# Altium project jetson_xavier_nx_board.PrjPcb (part 2 of 2)

## Sheet usb-debug.SchDoc: Jetson Xavier NX Board
size A3; PageSetup: Record=PageOptions|CenterHorizontal=True|CenterVertical=True|PrintScale=0.97|XCorrection=1.00|YCorrection=1.00|PrintKind=1|BorderSize=5000000|LeftOffset=0|BottomOffset=0|Orientation=2|PaperLength=2970|PaperWidth=2100|Scale=100|PaperSource=7|PrintQuality=600|MediaType=1|DitherType=10|PaperKind=A4|PrintScaleMode=1; Organization: Altium Limited; Address1: 3 Minna Close; Address2: Belrose; Address3: NSW 2085; Address4: Australia; Revision: Rev01
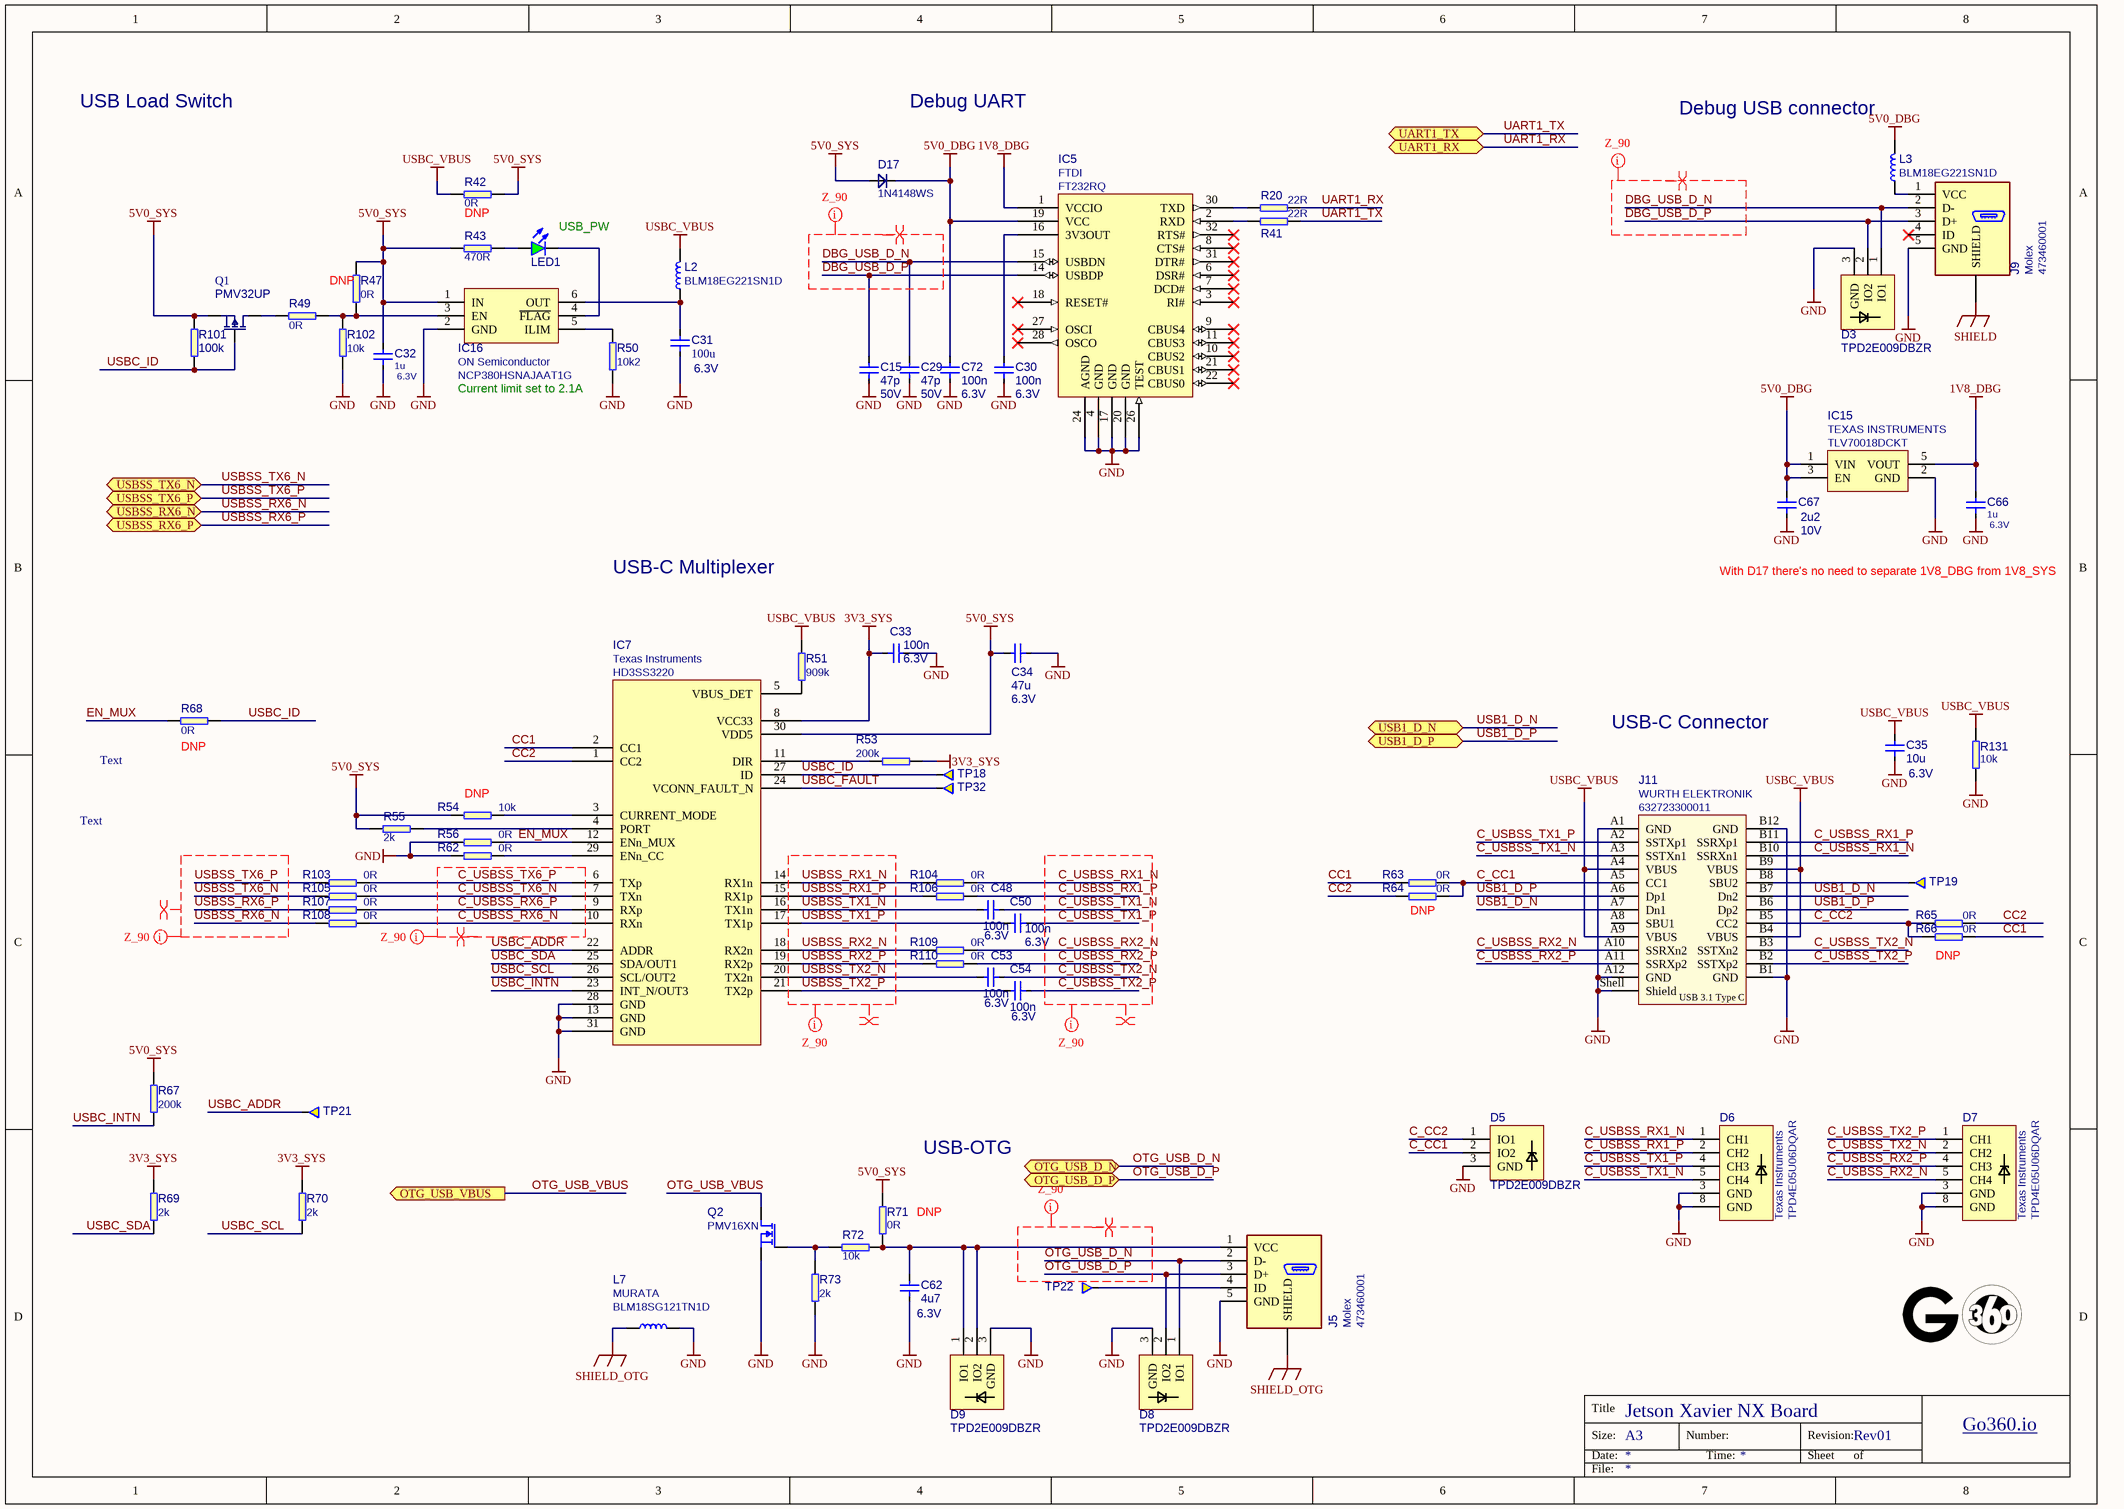
[diagram p6: usb-debug.SchDoc]

### Parts
C15  Voltage: 50V  [0402]  (hidden comment: 47p)
C29  Voltage: 50V  [0402]  (hidden comment: 47p)
C30  Voltage: 6.3V  [0402]  (hidden comment: 100n)
C31  Voltage: 6.3V  [1206]  (hidden comment: 100u)
C32  Voltage: 6.3V  [0402]  (hidden comment: 1u)
C33  Voltage: 6.3V  [0402]  (hidden comment: 100n)
C34  Voltage: 6.3V  [0805]  (hidden comment: 47u)
C35  Voltage: 6.3V  [0603]  (hidden comment: 10u)
C48  Voltage: 6.3V  [0402]  (hidden comment: 100n)
C50  Voltage: 6.3V  [0402]  (hidden comment: 100n)
C53  Voltage: 6.3V  [0402]  (hidden comment: 100n)
C54  Voltage: 6.3V  [0402]  (hidden comment: 100n)
C62  Voltage: 6.3V  [0402]  (hidden comment: 4u7)
C66  Voltage: 6.3V  [0402]  (hidden comment: 1u)
C67  Voltage: 10V  [0402]  (hidden comment: 2u2)
C72  Voltage: 6.3V  [0402]  (hidden comment: 100n)
D3  TPD2E009DBZR  [SOT-23]
D5  TPD2E009DBZR  [SOT-23]
D6  Manufacturer: Texas Instruments  PartSymbol: TPD4E05U06DQAR  [TPD4E05U06_PASS]  (hidden comment: TPD4E05U06)
D7  Manufacturer: Texas Instruments  PartSymbol: TPD4E05U06DQAR  [TPD4E05U06_PASS]  (hidden comment: TPD4E05U06)
D8  TPD2E009DBZR  [SOT-23s]
D9  TPD2E009DBZR  [SOT-23s]
D17  1N4148WS  [SOD-323]
IC5  Manufacturer: FTDI  [QFN-32]  (hidden comment: FT232RQ)
IC7  HD3SS3220  Manufacturer: Texas Instruments  [RNH0030A]
IC15  TLV70018DCKT  Manufacturer: TEXAS INSTRUMENTS  [SC70-5]
IC16  NCP380HSNAJAAT1G  Manufacturer: ON Semiconductor  [TSOP-6]
J5  Manufacturer: Molex  PartSymbol: 473460001  [CON-Molex-047346-0001]  (hidden comment: Molex 47346-0001)
J9  Manufacturer: Molex  PartSymbol: 473460001  [CON-Molex-047346-0001]  (hidden comment: Molex 47346-0001)
J11  632723300011  Manufacturer: WURTH ELEKTRONIK  [WE_632723300011]
L2  BLM18EG221SN1D  [0603]
L3  BLM18EG221SN1D  [0603]
L7  BLM18SG121TN1D  Manufacturer: MURATA  [0603]
LED1  KPT-1608SGC  [LED0603]  (value not drawn)
Q1  PMV32UP  [SOT-23s]
Q2  PMV16XN  [SOT-23s]
R20  22R  [0402]
R41  22R  [0402]
R42  0R  [0402]
R43  470R  [0402]
R47  0R  [0402]
R49  0R  [0402]
R50  10k2  [0402]
R51  909k  [0402]
R53  200k  [0402]
R54  10k  [0402]
R55  2k  [0402]
R56  0R  [0402]
R62  0R  [0402]
R63  0R  [0402]
R64  0R  [0402]
R65  0R  [0402]
R66  0R  [0402]
R67  200k  [0402]
R68  0R  [0402]
R69  2k  [0402]
R70  2k  [0402]
R71  0R  [0402]
R72  10k  [0402]
R73  2k  [0402]
R101  100k  [0402]
R102  10k  [0402]
R103  0R  [0402]
R104  0R  [0402]
R105  0R  [0402]
R106  0R  [0402]
R107  0R  [0402]
R108  0R  [0402]
R109  0R  [0402]
R110  0R  [0402]
R131  10k  [0402]
TP18  Testpad  [TP-R-1.5]  (value not drawn)  (no BOM)
TP19  Testpad  [TP-R-1.5]  (value not drawn)  (no BOM)
TP21  Testpad  [TP-R-1.5]  (value not drawn)  (no BOM)
TP22  Testpad  [TP-R-1.5]  (value not drawn)  (no BOM)
TP32  Testpad  [TP-R-1.5]  (value not drawn)  (no BOM)

### Ports
OTG_USB_D_N, OTG_USB_D_P, OTG_USB_VBUS (out), UART1_RX, UART1_TX, USB1_D_N, USB1_D_P, USBSS_RX6_N, USBSS_RX6_P, USBSS_TX6_N, USBSS_TX6_P

### Nets
1V8_DBG: C66.2 IC5.1(VCCIO) IC15.5(VOUT)
3V3_SYS: C33.1 IC7.8(VCC33) R53.2 R69.1 R70.1
5V0_DBG: C67.2 C72.2 D17.C IC5.19(VCC) IC15.1(VIN) IC15.3(EN) L3.2
5V0_SYS: C32.2 C34.2 D17.A IC7.30(VDD5) IC16.1(IN) Q1.2(S) R42.1 R43.2 R47.2 R54.1 R55.1 R67.2 R71.2 R101.2
GND: C15.1 C29.1 C30.1 C31.1 C32.1 C33.2 C34.1 C35.1 C62.1 C66.1 C67.1 C72.1 D3.3(GND) D5.3(GND) D6.3(GND) D6.8(GND) D7.3(GND) D7.8(GND) D8.3(GND) D9.3(GND) IC5.4(GND) IC5.17(GND) IC5.20(GND) IC5.24(AGND) IC5.26(TEST) IC7.13(GND) IC7.28(GND) IC7.31(GND) IC15.2(GND) IC16.2(GND) J5.5(GND) J9.5(GND) J11.A1(GND) J11.A12(GND) J11.B1(GND) J11.B12(GND) J11.Shell(Shield) L7.2 Q2.2(S) R50.1 R56.1 R62.1 R73.2 R102.1 R131.1
SHIELD: J9.S(SHIELD)
SHIELD_OTG: J5.S(SHIELD) L7.1
USBC_VBUS: C35.2 J11.A4(VBUS) J11.A9(VBUS) J11.B4(VBUS) J11.B9(VBUS) L2.2 R42.2 R51.2 R131.2
C_CC1: D5.2(IO2) J11.A5(CC1) R63.2 R64.2
C_CC2: D5.1(IO1) J11.B5(CC2) R65.1 R66.1
C_USBSS_RX1_N: D6.1(CH1) J11.B10(SSRXn1) R104.2
C_USBSS_RX1_P: D6.2(CH2) J11.B11(SSRXp1) R106.2
C_USBSS_RX2_N: D7.5(CH4) J11.A10(SSRXn2) R109.2
C_USBSS_RX2_P: D7.4(CH3) J11.A11(SSRXp2) R110.2
C_USBSS_RX6_N: IC7.10(RXn) R108.2
C_USBSS_RX6_P: IC7.9(RXp) R107.2
C_USBSS_TX1_N: C48.1 D6.5(CH4) J11.A3(SSTXn1)
C_USBSS_TX1_P: C50.1 D6.4(CH3) J11.A2(SSTXp1)
C_USBSS_TX2_N: C53.1 D7.2(CH2) J11.B3(SSTXn2)
C_USBSS_TX2_P: C54.1 D7.1(CH1) J11.B2(SSTXp2)
C_USBSS_TX6_N: IC7.7(TXn) R105.2
C_USBSS_TX6_P: IC7.6(TXp) R103.2
CC1: IC7.2(CC1) R63.1 R66.2
CC2: IC7.1(CC2) R64.1 R65.2
DBG_USB_D_N: C29.2 D3.1(IO1) IC5.15(USBDN) J9.2(D-)
DBG_USB_D_P: C15.2 D3.2(IO2) IC5.14(USBDP) J9.3(D+)
EN_MUX: IC7.12(ENn_MUX) R56.2 R68.1
OTG_USB_D_N: D8.1(IO1) J5.2(D-) ; port OTG_USB_D_N
OTG_USB_D_P: D8.2(IO2) J5.3(D+) ; port OTG_USB_D_P
OTG_USB_VBUS: Q2.3(D) ; port OTG_USB_VBUS
UART1_RX: R20.2 ; port UART1_RX
UART1_TX: R41.2 ; port UART1_TX
USB1_D_N: J11.A7(Dn1) J11.B7(Dn2) ; port USB1_D_N
USB1_D_P: J11.A6(Dp1) J11.B6(Dp2) ; port USB1_D_P
USBC_ADDR: IC7.22(ADDR) TP21.1
USBC_FAULT: IC7.24(VCONN_FAULT_N) TP32.1
USBC_ID: IC7.27(ID) Q1.1(G) R68.2 R101.1 TP18.1
USBC_INTN: IC7.23(INT_N/OUT3) R67.1
USBC_SCL: IC7.26(SCL/OUT2) R70.2
USBC_SDA: IC7.25(SDA/OUT1) R69.2
USBSS_RX1_N: IC7.14(RX1n) R104.1
USBSS_RX1_P: IC7.15(RX1p) R106.1
USBSS_RX2_N: IC7.18(RX2n) R109.1
USBSS_RX2_P: IC7.19(RX2p) R110.1
USBSS_RX6_N: R108.1 ; port USBSS_RX6_N
USBSS_RX6_P: R107.1 ; port USBSS_RX6_P
USBSS_TX1_N: C48.2 IC7.16(TX1n)
USBSS_TX1_P: C50.2 IC7.17(TX1p)
USBSS_TX2_N: C53.2 IC7.20(TX2n)
USBSS_TX2_P: C54.2 IC7.21(TX2p)
USBSS_TX6_N: R105.1 ; port USBSS_TX6_N
USBSS_TX6_P: R103.1 ; port USBSS_TX6_P
NetC30_2: C30.2 IC5.16(3V3OUT)
NetC31_2: C31.2 IC16.6(OUT) L2.1
NetC62_2: C62.2 D9.1(IO1) D9.2(IO2) J5.1(VCC) R71.1 R72.1
NetIC5_2: IC5.2(RXD) R41.1
NetIC5_30: IC5.30(TXD) R20.1
NetIC7_3: IC7.3(CURRENT_MODE) R54.2
NetIC7_4: IC7.4(PORT) R55.2
NetIC7_5: IC7.5(VBUS_DET) R51.1
NetIC7_11: IC7.11(DIR) R53.1
NetIC7_29: IC7.29(ENn_CC) R62.2
NetIC16_3: IC16.3(EN) R47.1 R49.2 R102.2
NetIC16_4: IC16.4(~{FLAG}) LED1.K
NetIC16_5: IC16.5(ILIM) R50.2
NetJ5_4: J5.4(ID) TP22.1
NetJ9_1: J9.1(VCC) L3.1
NetJ11_B8: J11.B8(SBU2) TP19.1
NetLED1_A: LED1.A R43.1
NetQ1_3: Q1.3(D) R49.1
NetQ2_1: Q2.1(G) R72.2 R73.1

Not connected (* = marked no-connect by the designer): IC5 3(RI#)* 6(DSR#)* 7(DCD#)* 8(CTS#)* 9(CBUS4)* 10(CBUS2)* 11(CBUS3)* 18(RESET#)* 21(CBUS1)* 22(CBUS0)* 27(OSCI)* 28(OSCO)* 31(DTR#)* 32(RTS#)*; J9 4(ID)*; J11 A8(SBU1)

### Layout directives
differential pair: C_USBSS_RX1_N, C_USBSS_RX1_P, C_USBSS_RX2_N, C_USBSS_RX2_P, C_USBSS_RX6_N, C_USBSS_RX6_P, C_USBSS_TX1_N, C_USBSS_TX1_P, C_USBSS_TX2_N, C_USBSS_TX2_P, C_USBSS_TX6_N, C_USBSS_TX6_P, DBG_USB_D_N, DBG_USB_D_P, OTG_USB_D_N, OTG_USB_D_P, USBSS_RX1_N, USBSS_RX1_P, USBSS_RX2_N, USBSS_RX2_P, USBSS_RX6_N, USBSS_RX6_P, USBSS_TX1_N, USBSS_TX1_P, USBSS_TX2_N, USBSS_TX2_P, USBSS_TX6_N, USBSS_TX6_P
net class Z_90: C_USBSS_RX1_N, C_USBSS_RX1_P, C_USBSS_RX2_N, C_USBSS_RX2_P, C_USBSS_RX6_N, C_USBSS_RX6_P, C_USBSS_TX1_N, C_USBSS_TX1_P, C_USBSS_TX2_N, C_USBSS_TX2_P, C_USBSS_TX6_N, C_USBSS_TX6_P, DBG_USB_D_N, DBG_USB_D_P, OTG_USB_D_N, OTG_USB_D_P, USBSS_RX1_N, USBSS_RX1_P, USBSS_RX2_N, USBSS_RX2_P, USBSS_RX6_N, USBSS_RX6_P, USBSS_TX1_N, USBSS_TX1_P, USBSS_TX2_N, USBSS_TX2_P, USBSS_TX6_N, USBSS_TX6_P

### Notes on the sheet
- USB Load Switch
- Debug UART
- (near L3) Debug USB connector
- (near R42) DNP
- (near LED1) USB_PW
- (near R47) DNP
- (near R50) Current limit set to 2.1A
- USB-C Multiplexer
- With D17 there's no need to separate 1V8_DBG from 1V8_SYS
- Text
- (near R68) DNP
- USB-C Connector
- (near R54) DNP
- (near R64) DNP
- (near R66) DNP
- USB-OTG
- DNP
- Title
- Size:
- Date:
- A3
- Number:
- Time:
- Revision:
- Sheet
- of
- Go360.io
- File:
- (in symbol WE_632723300011) USB 3.1 Type C

### Library data of the parts
C15 C29 = C_47p_0402: MLCC SMT Capacitor 47pF 0402; Manufacturer: KEMET; PartSymbol: C0402C470J5GACTU; PartNumber: C_47p_0402; Value: 47p
C30 C33 C72 = C_100n_0402: MLCC SMT Capacitor 100n 0402; Manufacturer: TDK; PartSymbol: C1005X5R0J104K050BA; Value: 100n; PartNumber: C_100n_0402
C31 = C_100u_1206: MLCC SMT Capacitor 100uF 1206; Manufacturer: KEMET; PartSymbol: C1206C107M9PACTU; PartNumber: C_100u_1206; Value: 100u
C32 C66 = C_1u_0402: MLCC SMT Capacitor 1uF 0402; Manufacturer: MULTICOMP; PartSymbol: MC0402F105Z6R3CT; PartNumber: C_1u_0402; Value: 1u
C34 = C_47u_0805: MLCC SMT Capacitor 47uF 0805; Manufacturer: KEMET; PartSymbol: C0805C476M9PACTU; PartNumber: C_47u_0805; Value: 47u
C35 = C_10u_0603: MLCC SMT Capacitor 10uF 0603; Manufacturer: Walsin; PartSymbol: 0603X106M6R3CT; PartNumber: C_10u_0603; Value: 10u
C48 C50 C53 C54 = C_100n_0402: MLCC SMT Capacitor 100n 0402; Manufacturer: TDK; PartSymbol: C1005X5R0J104K050BA; Voltage: 6.3; Value: 100n; PartNumber: C_100n_0402
C62 = C_4u7_0402: MLCC SMT Capacitor 4.7uF 0402; Manufacturer: MURATA; PartSymbol: GRM155R60J475ME87D; PartNumber: C_4u7_0402; Value: 4u7
C67 = C_2u2_0402: MLCC SMT Capacitor 2.2uF 0402; Manufacturer: TDK; PartSymbol: C1005X5R1A225K050BC; Value: 2u2; PartNumber: C_2u2_0402
D3 D5 D8 D9 = TPD2E009DBZR: DIODE, SCHOTTKY, 30V, 200MA, SOT-23; Manufacturer: NXP; PartNumber: TPD2E009DBZR; Value: TPD2E009DBZR; MPN: TPD2E009DBZR
D6 D7 = TPD4E05U06: ESD Suppressors 4-CH; PartNumber: TPD4E05U06_PASS; Value: TPD4E05U06
D17 = diode: Diode small signal; Manufacturer: ON SEMICONDUCTOR; PartNumber: 1N4148WS; Value: 1N4148WS; PartSymbol: 1N4148WS
IC5 = FT232RQ: USB to serial UART interface; PartSymbol: FT232RQ-REEL; Value: FT232RQ; PartNumber: FT232RQ
IC7 = HD3SS3220: IC DRP PORT CTLR USB-C 30WQFN; PartSymbol: HD3SS3220RNHT; PartNumber: HD3SS3220; Value: HD3SS3220
IC15 = TLV700: Voltage Regulator, 2V to 5.5V, 175mV Dropout, 1.8Vout, 200mAout; Value: TLV70018DCKT; PartNumber: TLV70018DCKT; PartSymbol: TLV70018DCKT
IC16 = NCP380HSNAJAAT1G: POWER LOAD SWITCH, HIGH SIDE; Value: NCP380HSNAJAAT1G; PartNumber: NCP380HSNAJAAT1G; PartSymbol: NCP380HSNAJAAT1G
J5 J9 = Micro USB B: USB - micro B Receptacle Connector 5 Position Surface Mount, Right Angle, Horizontal; PartNumber: CON-Molex-47346-0001; Value: Molex 47346-0001
J11 = WE_632723300011: USB 3.1 Type C Receptacle Horizontal THR WR-COM; PartNumber: WE_632723300011; Value: 632723300011; PartSymbol: 632723300011
L2 L3 = BLM18EG221SN1D: MURATA  BLM18EG221SN1D  FERRITE BEAD, 0.05OHM, 2A, 0603; Value: BLM18EG221SN1D; Manufacturer: MURATA; PartNumber: BLM18EG221SN1D; PartSymbol: BLM18EG221SN1D
L7 = BLM18SG121TN1D: FERRITE BEAD, 0.025OHM, 3A, 0603; Value: BLM18SG121TN1D; PartNumber: BLM18SG121TN1D; PartSymbol: BLM18SG121TN1D
LED1 = LED: LED Green 0603 case; Manufacturer: KINGBRIGHT; PartNumber: LED_G; Value: KPT-1608SGC; PartSymbol: KPT-1608SGC
Q1 = PMOS: P CH, 20V, 4A; Manufacturer: NXP; PartNumber: PMV32UP; Value: PMV32UP; PartSymbol: PMV32UP
Q2 = NMOS_PMV16XN: MOSFET, N CH; Manufacturer: NXP; Value: PMV16XN; PartNumber: PMV16XN; PartSymbol: PMV16XN
R20 R41 = R_22R_0402: RES, 22R, 0402; Manufacturer: VISHAY; PartSymbol: CRCW040222R0FKED; Value: 22R; PartNumber: R_22R_0402
R42 R47 R49 R56 R62-R66 R68 R71 R103-R110 = R_0R_0402: RES, 0R, 0402; Manufacturer: Panasonic; PartSymbol: ERJ2GE0R00X; PartNumber: R_0R_0402; Value: 0R
R43 = R_470R_0402: RES, 470R, 0402; Manufacturer: VISHAY; PartSymbol: CRCW0402470RFKED.; PartNumber: R_470R_0402; Value: 470R
R50 = R_10k2_0402: RES, 10k2, 0402, 0.1%; PartNumber: R_10k2_0402_0.1%; Manufacturer: TE CONECTIVITY; PartSymbol: CPF0402B10K2E1; Value: 10k2; Tolerance: 0.1%
R51 = R_909k_0402: RES, 909k, 0402; Manufacturer: Panasonic; PartSymbol: ERJ2RKF9093X; PartNumber: R_909k_0402; Value: 909k
R53 R67 = R_200k_0402: RES, 200k, 0402; Manufacturer: YAGEO; PartSymbol: RC0402FR-07200KL; PartNumber: R_200k_0402; Value: 200k
R54 R72 R102 R131 = R_10k_0402: RES, 10k, 0402; Manufacturer: MULTICOMP; PartSymbol: MCMR04X1002FTL; PartNumber: R_10k_0402; Value: 10k
R55 R69 R70 R73 = R_2k_0402: RES, 2k, 0402; Manufacturer: VISHAY; PartSymbol: CRCW04022K00FKED; PartNumber: R_2k_0402; Value: 2k
R101 = R_100k_0402: SMT Resistor 100k 0402; Manufacturer: VISHAY; PartSymbol: CRCW0402100KFKEDHP; Tolerance: 1%; PartNumber: R_100k_0402; Value: 100k
TP18 TP19 TP21 TP22 TP32 = Testpad: Testpad, round, 1.5mm; PartNumber: TP-R-1.5

## Sheet display.SchDoc: Jetson Xavier NX Board
size A3; PageSetup: Record=PageOptions|CenterHorizontal=True|CenterVertical=True|PrintScale=0.97|XCorrection=1.00|YCorrection=1.00|PrintKind=1|BorderSize=5000000|LeftOffset=0|BottomOffset=0|Orientation=2|PaperLength=2970|PaperWidth=2100|Scale=100|PaperSource=7|PrintQuality=600|MediaType=1|DitherType=10|PaperKind=A4|PrintScaleMode=1; Organization: Altium Limited; Address1: 3 Minna Close; Address2: Belrose; Address3: NSW 2085; Address4: Australia; Revision: Rev01
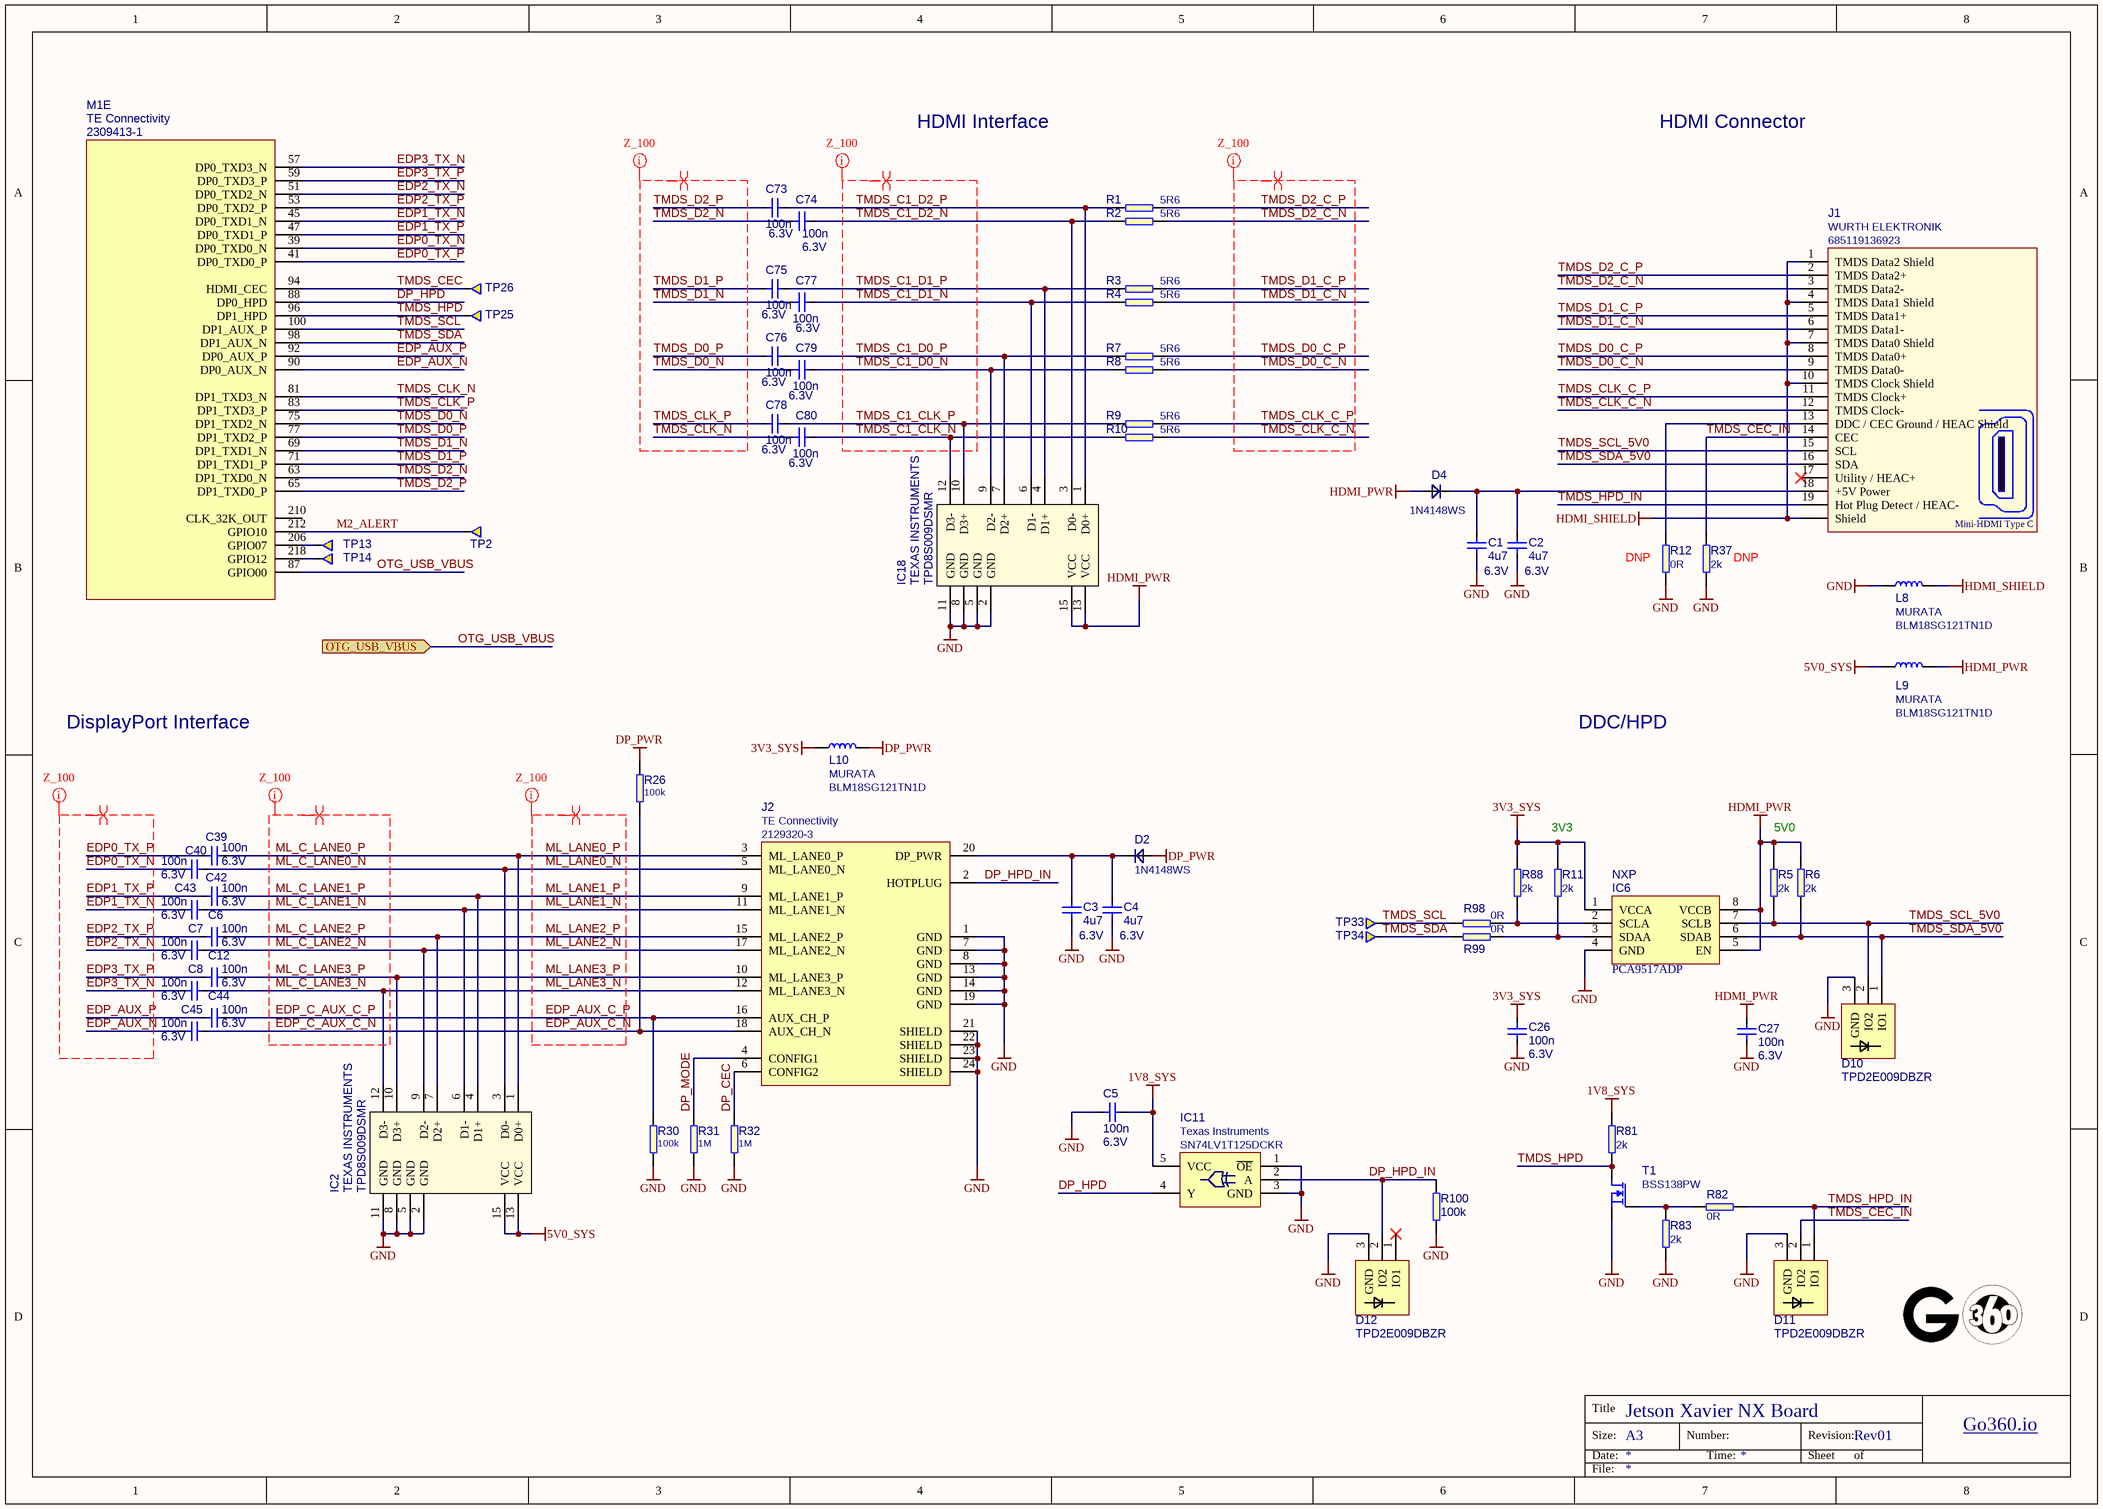
[diagram p7: display.SchDoc]

### Parts
(Parts that share a designator on the sheet are numbered #1, #2 ... from top to bottom, then left to right.)
C1  Voltage: 6.3V  [0402]  (hidden comment: 4u7)
C2  Voltage: 6.3V  [0402]  (hidden comment: 4u7)
C3  Voltage: 6.3V  [0402]  (hidden comment: 4u7)
C4  Voltage: 6.3V  [0402]  (hidden comment: 4u7)
C5  Voltage: 6.3V  [0402]  (hidden comment: 100n)
C6  Voltage: 6.3V  [0402]  (hidden comment: 100n)
C7  Voltage: 6.3V  [0402]  (hidden comment: 100n)
C8  Voltage: 6.3V  [0402]  (hidden comment: 100n)
C12  Voltage: 6.3V  [0402]  (hidden comment: 100n)
C26  Voltage: 6.3V  [0402]  (hidden comment: 100n)
C27  Voltage: 6.3V  [0402]  (hidden comment: 100n)
C39  Voltage: 6.3V  [0402]  (hidden comment: 100n)
C40  Voltage: 6.3V  [0402]  (hidden comment: 100n)
C42  Voltage: 6.3V  [0402]  (hidden comment: 100n)
C43  Voltage: 6.3V  [0402]  (hidden comment: 100n)
C44  Voltage: 6.3V  [0402]  (hidden comment: 100n)
C45  Voltage: 6.3V  [0402]  (hidden comment: 100n)
C73  Voltage: 6.3V  [0402]  (hidden comment: 100n)
C74  Voltage: 6.3V  [0402]  (hidden comment: 100n)
C75  Voltage: 6.3V  [0402]  (hidden comment: 100n)
C76  Voltage: 6.3V  [0402]  (hidden comment: 100n)
C77  Voltage: 6.3V  [0402]  (hidden comment: 100n)
C78  Voltage: 6.3V  [0402]  (hidden comment: 100n)
C79  Voltage: 6.3V  [0402]  (hidden comment: 100n)
C80  Voltage: 6.3V  [0402]  (hidden comment: 100n)
D2  1N4148WS  [SOD-323]
D4  1N4148WS  [SOD-323]
D10  TPD2E009DBZR  [SOT-23s]
D11  TPD2E009DBZR  [SOT-23s]
D12  TPD2E009DBZR  [SOT-23s]
IC2  Manufacturer: TEXAS INSTRUMENTS  PartSymbol: TPD8S009DSMR  [SON-15]  (hidden comment: TPD8S009)
IC6  PCA9517ADP  [MSOP-8]
IC11  SN74LV1T125DCKR  Manufacturer: Texas Instruments  [SC70-5]
IC18  Manufacturer: TEXAS INSTRUMENTS  PartSymbol: TPD8S009DSMR  [SON-15]  (hidden comment: TPD8S009)
J1  685119136923  Manufacturer: WURTH ELEKTRONIK  [WE_685119136923]
J2  2129320-3  Manufacturer: TE Connectivity  [2129320-3]
L8  BLM18SG121TN1D  Manufacturer: MURATA  [0603]
L9  BLM18SG121TN1D  Manufacturer: MURATA  [0603]
L10  BLM18SG121TN1D  Manufacturer: MURATA  [0603]
M1#2  Manufacturer: TE Connectivity  [jetson-nano-connector]  (hidden comment: 2309413-1)  (part E of 7)
R1  5R6  [0402]
R2  5R6  [0402]
R3  5R6  [0402]
R4  5R6  [0402]
R5  2k  [0402]
R6  2k  [0402]
R7  5R6  [0402]
R8  5R6  [0402]
R9  5R6  [0402]
R10  5R6  [0402]
R11  2k  [0402]
R12  0R  [0402]
R26  100k  [0402]
R30  100k  [0402]
R31  1M  [0402]
R32  1M  [0402]
R37  2k  [0402]
R81  2k  [0402]
R82  0R  [0402]
R83  2k  [0402]
R88  2k  [0402]
R98  0R  [0402]
R99  0R  [0402]
R100  100k  [0402]
T1  BSS138PW  [SC70-3]
TP2  Testpad  [TP-R-1.5]  (value not drawn)  (no BOM)
TP13  Testpad  [TP-R-1.5]  (value not drawn)  (no BOM)
TP14  Testpad  [TP-R-1.5]  (value not drawn)  (no BOM)
TP25  Testpad  [TP-R-1.5]  (value not drawn)  (no BOM)
TP26  Testpad  [TP-R-1.5]  (value not drawn)  (no BOM)
TP33  Testpad  [TP-R-1.5]  (value not drawn)  (no BOM)
TP34  Testpad  [TP-R-1.5]  (value not drawn)  (no BOM)

### Ports
OTG_USB_VBUS (in)

### Nets
1V8_SYS: C5.2 IC11.5(VCC) R81.1
3V3_SYS: C26.1 IC6.1(VCCA) L10.1 R11.1 R88.1
5V0_SYS: IC2.13(VCC) IC2.15(VCC) L9.1
DP_PWR: D2.A L10.2 R26.2
GND: C1.1 C2.1 C3.1 C4.1 C5.1 C26.2 C27.1 D10.3(GND) D11.3(GND) D12.3(GND) IC2.2(GND) IC2.5(GND) IC2.8(GND) IC2.11(GND) IC6.4(GND) IC11.1(~{OE}) IC11.3(GND) IC18.2(GND) IC18.5(GND) IC18.8(GND) IC18.11(GND) J2.1(GND) J2.7(GND) J2.8(GND) J2.13(GND) J2.14(GND) J2.19(GND) J2.21(SHIELD) J2.22(SHIELD) J2.23(SHIELD) J2.24(SHIELD) L8.1 R12.1 R30.1 R31.1 R32.1 R37.2 R83.2 R100.1 T1.2(S)
HDMI_PWR: C27.2 D4.A IC6.5(EN) IC6.8(VCCB) IC18.13(VCC) IC18.15(VCC) L9.2 R5.1 R6.1
HDMI_SHIELD: J1.1(TMDS_Data2_Shield) J1.4(TMDS_Data1_Shield) J1.7(TMDS_Data0_Shield) J1.10(TMDS_Clock_Shield) J1.Shell(Shield) L8.2
DP_CEC: J2.6(CONFIG2) R32.2
DP_HPD: IC11.4(Y) M1#2.88(DP0_HPD)
DP_HPD_IN: D12.2(IO2) IC11.2(A) J2.2(HOTPLUG) R100.2
DP_MODE: J2.4(CONFIG1) R31.2
EDP0_TX_N: C40.1 M1#2.39(DP0_TXD0_N)
EDP0_TX_P: C39.1 M1#2.41(DP0_TXD0_P)
EDP1_TX_N: C43.1 M1#2.45(DP0_TXD1_N)
EDP1_TX_P: C42.1 M1#2.47(DP0_TXD1_P)
EDP2_TX_N: C7.1 M1#2.51(DP0_TXD2_N)
EDP2_TX_P: C6.1 M1#2.53(DP0_TXD2_P)
EDP3_TX_N: C12.1 M1#2.57(DP0_TXD3_N)
EDP3_TX_P: C8.1 M1#2.59(DP0_TXD3_P)
EDP_AUX_C_N: C45.2 J2.18(AUX_CH_N) R26.1  [also labelled EDP_C_AUX_C_N]
EDP_AUX_C_P: C44.2 J2.16(AUX_CH_P) R30.2  [also labelled EDP_C_AUX_C_P]
EDP_AUX_N: C45.1 M1#2.90(DP0_AUX_N)
EDP_AUX_P: C44.1 M1#2.92(DP0_AUX_P)
M2_ALERT: M1#2.212(GPIO10) TP2.1
ML_C_LANE0_N: C40.2 IC2.3(D0-) J2.5(ML_LANE0_N)  [also labelled ML_LANE0_N]
ML_C_LANE0_P: C39.2 IC2.1(D0+) J2.3(ML_LANE0_P)  [also labelled ML_LANE0_P]
ML_C_LANE1_N: C43.2 IC2.6(D1-) J2.11(ML_LANE1_N)  [also labelled ML_LANE1_N]
ML_C_LANE1_P: C42.2 IC2.4(D1+) J2.9(ML_LANE1_P)  [also labelled ML_LANE1_P]
ML_C_LANE2_N: C7.2 IC2.9(D2-) J2.17(ML_LANE2_N)  [also labelled ML_LANE2_N]
ML_C_LANE2_P: C6.2 IC2.7(D2+) J2.15(ML_LANE2_P)  [also labelled ML_LANE2_P]
ML_C_LANE3_N: C12.2 IC2.12(D3-) J2.12(ML_LANE3_N)  [also labelled ML_LANE3_N]
ML_C_LANE3_P: C8.2 IC2.10(D3+) J2.10(ML_LANE3_P)  [also labelled ML_LANE3_P]
OTG_USB_VBUS: M1#2.87(GPIO00) ; port OTG_USB_VBUS
TMDS_C1_CLK_N: C80.2 IC18.12(D3-) R10.1
TMDS_C1_CLK_P: C78.2 IC18.10(D3+) R9.1
TMDS_C1_D0_N: C79.2 IC18.9(D2-) R8.1
TMDS_C1_D0_P: C76.2 IC18.7(D2+) R7.1
TMDS_C1_D1_N: C77.2 IC18.6(D1-) R4.1
TMDS_C1_D1_P: C75.2 IC18.4(D1+) R3.1
TMDS_C1_D2_N: C74.2 IC18.3(D0-) R2.1
TMDS_C1_D2_P: C73.2 IC18.1(D0+) R1.1
TMDS_CEC: M1#2.94(HDMI_CEC) TP26.1
TMDS_CEC_IN: D11.2(IO2) J1.14(CEC) R37.1
TMDS_CLK_C_N: J1.12(TMDS_Clock-) R10.2
TMDS_CLK_C_P: J1.11(TMDS_Clock+) R9.2
TMDS_CLK_N: C80.1 M1#2.81(DP1_TXD3_N)
TMDS_CLK_P: C78.1 M1#2.83(DP1_TXD3_P)
TMDS_D0_C_N: J1.9(TMDS_Data0-) R8.2
TMDS_D0_C_P: J1.8(TMDS_Data0+) R7.2
TMDS_D0_N: C79.1 M1#2.75(DP1_TXD2_N)
TMDS_D0_P: C76.1 M1#2.77(DP1_TXD2_P)
TMDS_D1_C_N: J1.6(TMDS_Data1-) R4.2
TMDS_D1_C_P: J1.5(TMDS_Data1+) R3.2
TMDS_D1_N: C77.1 M1#2.69(DP1_TXD1_N)
TMDS_D1_P: C75.1 M1#2.71(DP1_TXD1_P)
TMDS_D2_C_N: J1.3(TMDS_Data2-) R2.2
TMDS_D2_C_P: J1.2(TMDS_Data2+) R1.2
TMDS_D2_N: C74.1 M1#2.63(DP1_TXD0_N)
TMDS_D2_P: C73.1 M1#2.65(DP1_TXD0_P)
TMDS_HPD: M1#2.96(DP1_HPD) R81.2 T1.3(D) TP25.1
TMDS_HPD_IN: D11.1(IO1) J1.19(Hot_Plug_Detect_/_HEAC-) R82.1
TMDS_SCL: M1#2.100(DP1_AUX_P) R98.2 TP33.1
TMDS_SCL_5V0: D10.2(IO2) IC6.7(SCLB) J1.15(SCL) R5.2
TMDS_SDA: M1#2.98(DP1_AUX_N) R99.2 TP34.1
TMDS_SDA_5V0: D10.1(IO1) IC6.6(SDAB) J1.16(SDA) R6.2
NetC1_2: C1.2 C2.2 D4.C J1.18(+5V_Power)
NetC3_2: C3.2 C4.2 D2.C J2.20(DP_PWR)
NetIC6_2: IC6.2(SCLA) R88.2 R98.1
NetIC6_3: IC6.3(SDAA) R11.2 R99.1
NetJ1_13: J1.13(DDC_/_CEC_Ground_/_HEAC_Shield) R12.2
NetM1#2_206: M1#2.206(GPIO07) TP13.1
NetM1#2_218: M1#2.218(GPIO12) TP14.1
NetR82_2: R82.2 R83.1 T1.1(G)

Not connected (* = marked no-connect by the designer): D12 1(IO1)*; J1 17(Utility_/_HEAC+)*; M1#2 210(CLK_32K_OUT)

### Layout directives
differential pair: EDP0_TX_N, EDP0_TX_P, EDP1_TX_N, EDP1_TX_P, EDP2_TX_N, EDP2_TX_P, EDP3_TX_N, EDP3_TX_P, EDP_AUX_C_N, EDP_AUX_C_P, EDP_AUX_N, EDP_AUX_P, EDP_C_AUX_C_N, EDP_C_AUX_C_P, ML_C_LANE0_N, ML_C_LANE0_P, ML_C_LANE1_N, ML_C_LANE1_P, ML_C_LANE2_N, ML_C_LANE2_P, ML_C_LANE3_N, ML_C_LANE3_P, ML_LANE0_N, ML_LANE0_P, ML_LANE1_N, ML_LANE1_P, ML_LANE2_N, ML_LANE2_P, ML_LANE3_N, ML_LANE3_P, TMDS_C1_CLK_N, TMDS_C1_CLK_P, TMDS_C1_D0_N, TMDS_C1_D0_P, TMDS_C1_D1_N, TMDS_C1_D1_P, TMDS_C1_D2_N, TMDS_C1_D2_P, TMDS_CLK_C_N, TMDS_CLK_C_P, TMDS_CLK_N, TMDS_CLK_P, TMDS_D0_C_N, TMDS_D0_C_P, TMDS_D0_N, TMDS_D0_P, TMDS_D1_C_N, TMDS_D1_C_P, TMDS_D1_N, TMDS_D1_P, TMDS_D2_C_N, TMDS_D2_C_P, TMDS_D2_N, TMDS_D2_P
net class Z_100: EDP0_TX_N, EDP0_TX_P, EDP1_TX_N, EDP1_TX_P, EDP2_TX_N, EDP2_TX_P, EDP3_TX_N, EDP3_TX_P, EDP_AUX_C_N, EDP_AUX_C_P, EDP_AUX_N, EDP_AUX_P, EDP_C_AUX_C_N, EDP_C_AUX_C_P, ML_C_LANE0_N, ML_C_LANE0_P, ML_C_LANE1_N, ML_C_LANE1_P, ML_C_LANE2_N, ML_C_LANE2_P, ML_C_LANE3_N, ML_C_LANE3_P, ML_LANE0_N, ML_LANE0_P, ML_LANE1_N, ML_LANE1_P, ML_LANE2_N, ML_LANE2_P, ML_LANE3_N, ML_LANE3_P, TMDS_C1_CLK_N, TMDS_C1_CLK_P, TMDS_C1_D0_N, TMDS_C1_D0_P, TMDS_C1_D1_N, TMDS_C1_D1_P, TMDS_C1_D2_N, TMDS_C1_D2_P, TMDS_CLK_C_N, TMDS_CLK_C_P, TMDS_CLK_N, TMDS_CLK_P, TMDS_D0_C_N, TMDS_D0_C_P, TMDS_D0_N, TMDS_D0_P, TMDS_D1_C_N, TMDS_D1_C_P, TMDS_D1_N, TMDS_D1_P, TMDS_D2_C_N, TMDS_D2_C_P, TMDS_D2_N, TMDS_D2_P

### Notes on the sheet
- HDMI Interface
- HDMI Connector
- 1V8
- (near R12) DNP
- (near R37) DNP
- DisplayPort Interface
- DDC/HPD
- 3V3
- 5V0
- (near IC6) NXP
- Title
- Size:
- Date:
- A3
- Number:
- Time:
- Revision:
- Sheet
- of
- Go360.io
- File:
- (in symbol WE_685119136923) Mini-HDMI Type C

### Library data of the parts
C1-C4 = C_4u7_0402: as C62 on sheet usb-debug; PartNumber: C_4u7_0402; Value: 4u7
C5-C8 C12 C26 C27 C39 C40 C42-C45 C73-C80 = C_100n_0402: as C30 on sheet usb-debug; Value: 100n; PartNumber: C_100n_0402
D2 D4 = diode: as D17 on sheet usb-debug; Value: 1N4148WS; PartNumber: 1N4148WS; PartSymbol: 1N4148WS
D10-D12 = TPD2E009DBZR: as D3 on sheet usb-debug; PartNumber: TPD2E009DBZR; Value: TPD2E009DBZR; MPN: TPD2E009DBZR
IC2 IC18 = TPD8S009: 8-Channel ESD Protection for DisplayPort and HDMI; Value: TPD8S009; PartNumber: TPD8S009
IC6 = PCA9517ADP: IC REDRIVER I2C 1CH 8TSSOP; Manufacturer: NXP; Value: PCA9517ADP; PartNumber: PCA9517ADP; PartSymbol: PCA9517ADP
IC11 = SN74LV1T125: Buffer, 74LV1T125, 1.6 V to 5.5 V, SOT-23-5; PartNumber: SN74LV1T125DCKR; Value: SN74LV1T125DCKR; PartSymbol: SN74LV1T125DCKR
J1 = WE_685119136923: CONN HDMI FEMALE R/A 19POS 2.6MM; PartNumber: WE_685119136923; Value: 685119136923; PartSymbol: WE_685119136923
J2 = miniDP: Mini Displayport Reverse Offset; PartNumber: 2129320-3; Value: 2129320-3; PartSymbol: 2129320-3
L8-L10 = BLM18SG121TN1D: FERRITE BEAD, 0.025OHM, 3A, 0603; Value: BLM18SG121TN1D; PartNumber: BLM18SG121TN1D; PartSymbol: BLM18SG121TN1D
M1#2 = jetson-nano-new-release: PartNumber: 2309413-1; PartSymbol: 2309413-1; Value: 2309413-1
R1-R4 R7-R10 = R_5R6_0402: RES, 5R6, 0402; Manufacturer: Panasonic; PartSymbol: ERJ2GEJ5R6X; PartNumber: R_5R6_0402; Value: 5R6
R5 R6 R11 R37 R81 R83 R88 = R_2k_0402: as R55 on sheet usb-debug; PartNumber: R_2k_0402; Value: 2k
R12 R82 R98 R99 = R_0R_0402: as R42 on sheet usb-debug; PartNumber: R_0R_0402; Value: 0R
R26 R30 R100 = R_100k_0402: as R101 on sheet usb-debug; PartNumber: R_100k_0402; Value: 100k
R31 R32 = R_1M_0402: SMT Resistor 1M 0402; Manufacturer: VISHAY; PartSymbol: CRCW04021M00FKED; Tolerance: 1%; PartNumber: R_1M_0402; Value: 1M
T1 = NMOS: MOSFET, N CH, 60V, 0.2A; Manufacturer: NXP; Value: BSS138PW; PartNumber: BSS138PW; PartSymbol: BSS138PW
TP2 TP13 TP14 TP25 TP26 TP33 TP34 = Testpad: Testpad, round, 1.5mm; PartNumber: TP-R-1.5

## Nets that join several sheets
1V8_SYS: supply (C28.2 IC4.5 TP47.1), display (C5.2 IC11.5 R81.1)
3V3_HDMI1: csi (6 pins), supply (C58.2 IC9.4 L6.2 TP45.1)
3V3_HDMI2: csi (6 pins), supply (C56.2 IC8.4 L4.2 TP43.1)
3V3_SYS: csi (5 pins), ID-Serial (9 pins), interfaces (16 pins), SoM (J10.1 R112.2), supply (5 pins), usb-debug (5 pins), display (5 pins)
5V0_SYS: SoM (F1.1 R14.2 R97.2 R111.2), supply (25 pins), usb-debug (14 pins), display (IC2.13 IC2.15 L9.1)
EGND: interfaces (C14.1 J3.S), SoM (SP4.1)
GND: csi (41 pins), ID-Serial (15 pins), interfaces (33 pins), SoM (95 pins), supply (38 pins), usb-debug (45 pins), display (40 pins)
#MOD_SLEEP: SoM (M1#1.178), supply (R95.2)
#RESET: SoM (5 pins), supply (5 pins)
#SHUTDOWN_REQ: SoM (M1#1.233 TP28.1), supply (IC12.4 R86.1)
~{PEWAKE_3V3}: interfaces (R78.1 R137.1), SoM (M1#1.179)
CAM_XVS: csi (J6.1 J7.1 J13.1 J14.1), SoM (M1#1.127)
ENET_LED0: interfaces (J3.14), SoM (M1#1.194)
ENET_LED1: interfaces (J3.12), SoM (M1#1.188)
ENET_TRD0_N: interfaces (J3.1), SoM (M1#1.184)
ENET_TRD0_P: interfaces (J3.2), SoM (M1#1.186)
ENET_TRD1_N: interfaces (J3.3), SoM (M1#1.190)
ENET_TRD1_P: interfaces (J3.4), SoM (M1#1.192)
ENET_TRD2_N: interfaces (J3.7), SoM (M1#1.196)
ENET_TRD2_P: interfaces (J3.8), SoM (M1#1.198)
ENET_TRD3_N: interfaces (J3.9), SoM (M1#1.202)
ENET_TRD3_P: interfaces (J3.10), SoM (M1#1.204)
GEN0_SCL: ID-Serial (IC14.14 IC17.1 R118.2 TP30.4), SoM (M1#1.185 TP23.1)
GEN0_SDA: ID-Serial (5 pins), SoM (M1#1.187 TP24.1)
OTG_USB_D_N: SoM (M1#1.109), usb-debug (D8.1 J5.2)
OTG_USB_D_P: SoM (M1#1.111), usb-debug (D8.2 J5.3)
OTG_USB_VBUS: usb-debug (Q2.3), display (M1#2.87)
PCIE0_CLK_N: interfaces (J12.A14), SoM (M1#1.160)
PCIE0_CLK_P: interfaces (J12.A13), SoM (M1#1.162)
PCIE0_RX0_N: interfaces (J12.A17), SoM (M1#1.131)
PCIE0_RX0_P: interfaces (J12.A16), SoM (M1#1.133)
PCIE0_RX1_N: interfaces (J12.A22), SoM (M1#1.137)
PCIE0_RX1_P: interfaces (J12.A21), SoM (M1#1.139)
PCIE0_RX2_N: interfaces (J12.A26), SoM (M1#1.149)
PCIE0_RX2_P: interfaces (J12.A25), SoM (M1#1.151)
PCIE0_RX3_N: interfaces (J12.A30), SoM (M1#1.155)
PCIE0_RX3_P: interfaces (J12.A29), SoM (M1#1.157)
PCIE0_TX0_N: interfaces (C86.2), SoM (M1#1.134)
PCIE0_TX0_P: interfaces (C81.2), SoM (M1#1.136)
PCIE0_TX1_N: interfaces (C88.2), SoM (M1#1.140)
PCIE0_TX1_P: interfaces (C87.2), SoM (M1#1.142)
PCIE0_TX2_N: interfaces (C90.2), SoM (M1#1.148)
PCIE0_TX2_P: interfaces (C89.2), SoM (M1#1.150)
PCIE0_TX3_N: interfaces (C96.2), SoM (M1#1.154)
PCIE0_TX3_P: interfaces (C95.2), SoM (M1#1.156)
PEX_L0_RST_N: interfaces (R33.2 R136.2), SoM (M1#1.181)
PWR_EN: SoM (M1#1.237 TP27.1), supply (IC13.4 R130.1)
PWR_GOOD: SoM (T4.1), supply (IC3.10 R77.1 R87.1 TP40.1)
UART1_RX: SoM (M1#1.238), usb-debug (R20.2)
UART1_TX: SoM (M1#1.236), usb-debug (R41.2)
USB1_D_N: SoM (M1#1.115), usb-debug (J11.A7 J11.B7)
USB1_D_P: SoM (M1#1.117), usb-debug (J11.A6 J11.B6)
USBSS_RX6_N: SoM (M1#1.161), usb-debug (R108.1)
USBSS_RX6_P: SoM (M1#1.163), usb-debug (R107.1)
USBSS_TX6_N: SoM (M1#1.166), usb-debug (R105.1)
USBSS_TX6_P: SoM (M1#1.168), usb-debug (R103.1)
VSYNC_CAM1_1: csi (J7.15), SoM (M1#1.228)
VSYNC_CAM1_2: csi (J14.15), SoM (M1#1.216)
VSYNC_CAM2_2: csi (J6.15), SoM (M1#1.130)

## Assembly variants
Prototype: not fitted R23 R37 R42 R47 R54 R64 R66 R68 R71 R75 R77 R79 R87 R89 R91 R112 R121